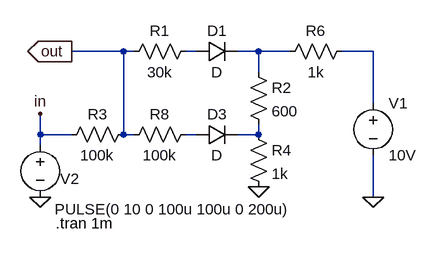
[diagram p0: schematic diode_exo2.asc]
diode_exo2.asc, the LTspice schematic file:
Version 4
SHEET 1 880 680
WIRE -128 48 -208 48
WIRE -112 48 -128 48
WIRE -16 48 -32 48
WIRE 80 48 48 48
WIRE 128 48 80 48
WIRE 256 48 208 48
WIRE 80 80 80 48
WIRE 256 128 256 48
WIRE -256 176 -256 144
WIRE -208 176 -256 176
WIRE -128 176 -128 48
WIRE -112 176 -128 176
WIRE -16 176 -32 176
WIRE 80 176 80 160
WIRE 80 176 48 176
WIRE -256 192 -256 176
WIRE 256 272 256 208
FLAG 256 272 0
FLAG -256 272 0
FLAG -208 48 out
IOPIN -208 48 Out
FLAG -256 144 in
FLAG 80 256 0
SYMBOL voltage 256 112 R0
WINDOW 123 0 0 Left 0
WINDOW 39 0 0 Left 0
SYMATTR InstName V1
SYMATTR Value 10V
SYMBOL res -112 160 R90
WINDOW 0 0 56 VBottom 0
WINDOW 3 32 56 VTop 0
SYMATTR InstName R3
SYMATTR Value 100k
SYMBOL voltage -256 176 R0
WINDOW 123 0 0 Left 0
WINDOW 39 0 0 Left 0
WINDOW 0 31 68 Left 0
WINDOW 3 22 115 Left 0
SYMATTR InstName V2
SYMATTR Value PULSE(0 10 0 100u 100u 0 200u)
SYMBOL diode -16 64 R270
WINDOW 0 32 32 VTop 0
WINDOW 3 0 32 VBottom 0
SYMATTR InstName D1
SYMBOL diode -16 192 R270
WINDOW 0 32 32 VTop 0
WINDOW 3 0 32 VBottom 0
SYMATTR InstName D3
SYMBOL res 64 64 R0
SYMATTR InstName R2
SYMATTR Value 600
SYMBOL res 64 160 R0
SYMATTR InstName R4
SYMATTR Value 1k
SYMBOL res 224 32 R90
WINDOW 0 0 56 VBottom 0
WINDOW 3 32 56 VTop 0
SYMATTR InstName R6
SYMATTR Value 1k
SYMBOL res -16 160 R90
WINDOW 0 0 56 VBottom 0
WINDOW 3 32 56 VTop 0
SYMATTR InstName R8
SYMATTR Value 100k
SYMBOL res -16 32 R90
WINDOW 0 0 56 VBottom 0
WINDOW 3 32 56 VTop 0
SYMATTR InstName R1
SYMATTR Value 30k
TEXT -232 312 Left 0 !.tran 1m

The netlist it stands for:
* diode_exo2.asc
V1 N003 0 10V
R3 out in 100k
V2 in 0 PULSE(0 10 0 100u 100u 0 200u)
D1 N001 N002 D
D3 N004 N005 D
R2 N002 N005 600
R4 N005 0 1k
R6 N003 N002 1k
R8 N004 out 100k
R1 N001 out 30k
.model D D
.lib standard.dio
.tran 1m
.backanno
.end